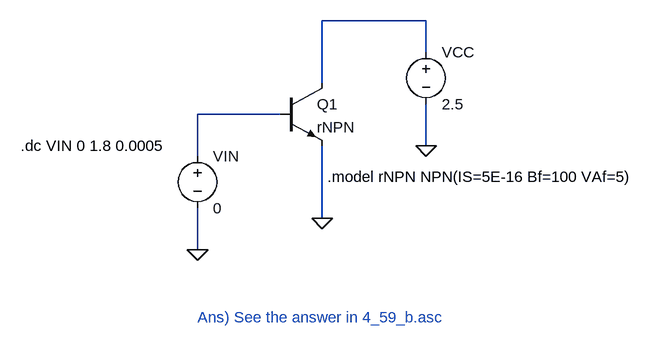
[diagram p0: schematic 4_59_a.asc]
4_59_a.asc, the LTspice schematic file:
Version 4
SHEET 1 1664 680
WIRE 320 -256 160 -256
WIRE 320 -208 320 -256
WIRE 160 -160 160 -256
WIRE 96 -112 -32 -112
WIRE 320 -64 320 -128
WIRE -32 -48 -32 -112
WIRE 160 48 160 -64
WIRE -32 96 -32 32
FLAG 160 48 0
FLAG 320 -64 0
FLAG -32 96 0
SYMBOL npn 96 -160 R0
SYMATTR InstName Q1
SYMATTR Value rNPN
SYMBOL voltage 320 -224 R0
SYMATTR InstName VCC
SYMATTR Value 2.5
SYMBOL voltage -32 -64 R0
SYMATTR InstName VIN
SYMATTR Value 0
TEXT 168 -16 Left 2 !.model rNPN NPN(IS=5E-16 Bf=100 VAf=5)
TEXT -304 -64 Left 2 !.dc VIN 0 1.8 0.0005
TEXT -32 200 Left 2 ;Ans) See the answer in 4_59_b.asc

The netlist it stands for:
* 4_59_a.asc
Q1 N001 N002 0 0 rNPN
VCC N001 0 2.5
VIN N002 0 0
.model NPN NPN
.model PNP PNP
.lib standard.bjt
.model rNPN NPN(IS=5E-16 Bf=100 VAf=5)
.dc VIN 0 1.8 0.0005
* Ans) See the answer in 4_59_b.asc
.backanno
.end

* Results of the author's LTspice run, read from the files saved beside the schematic
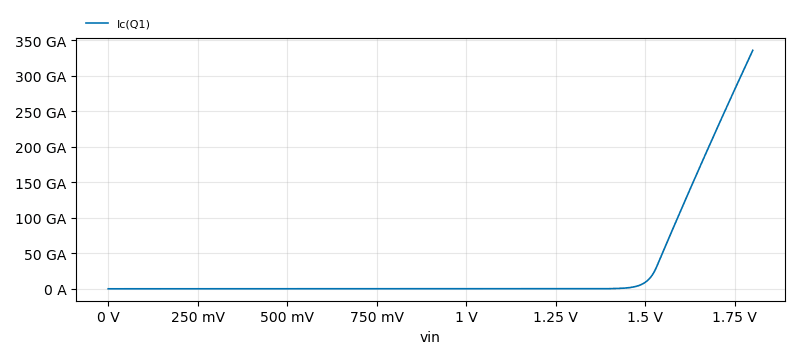
[diagram p1: DC transfer characteristic of 4_59_a.asc, plotted from the saved traces]
* DC transfer characteristic, 1 run:
*   Ic(Q1): 2.501 pA at vin=0 V, 335.7 GA at vin=1.8 V, min 2.434 pA, max 335.7 GA